# EAGLE design 240VAC_dimmer (EAGLE 6.3)
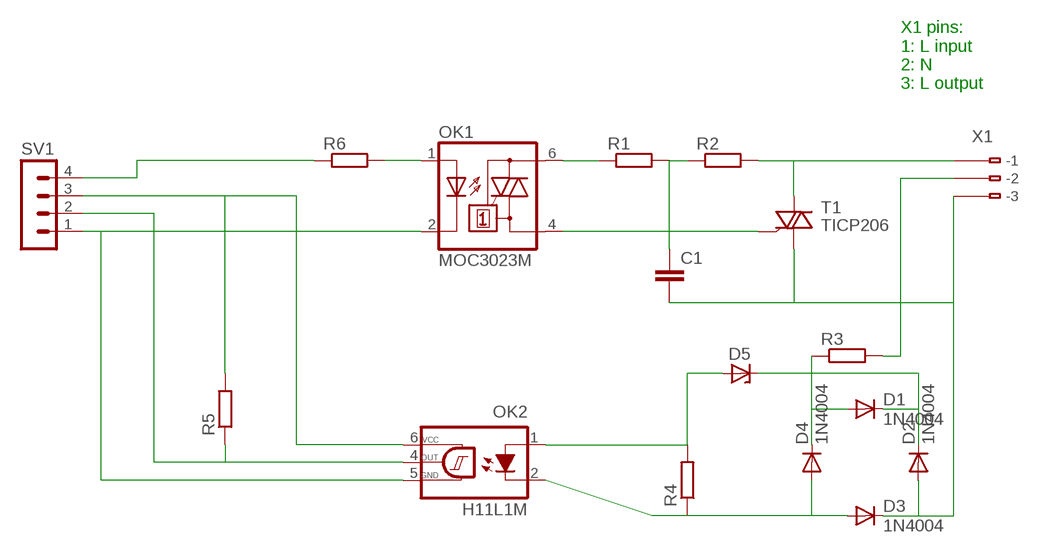
[diagram p0: schematic, sheet 1]

## Parts
C1  C-EU050-030X075  [C050-030X075]
D1  1N4004  [DO41-10]
D2  1N4004  [DO41-10]
D3  1N4004  [DO41-10]
D4  1N4004  [DO41-10]
D5  ZENER-DIODEDO41Z10  [DO41Z10]
OK1  MOC3023M  [DIL06]
OK2  H11L1M  [DIL06]
R1  R-EU_0411/12  [0411/12]
R2  R-EU_0411/12  [0411/12]
R3  R-EU_0207/10  [0207/10]
R4  R-EU_0204/7  [0204/7]
R5  R-EU_0204/7  [0204/7]
R6  R-EU_0204/7  [0204/7]
SV1  MA04-1  [MA04-1]
T1  TICP206  [TO92-6]
X1  233-103  [233-103]

## Nets
N$1: OK1.6(A2) R1.1
N$2: C1.1 R1.2 R2.1
N$3: R2.2 T1.A2 X1.B1(B-1)
N$4: OK1.4(A1) T1.G
N$5: C1.2 D2.A D3.C T1.A1 X1.B3(B-3)
N$6: D1.A D4.C R3.1
N$7: D3.A D4.A OK2.2(C) R4.1
N$8: D5.A OK2.1(A) R4.2
N$9: D1.C D2.C D5.C
N$10: OK1.2(C) OK2.5(GND) SV1.1
N$11: OK2.4(OUT) R5.1 SV1.2
N$12: OK2.6(VCC) R5.2 SV1.3
N$13: OK1.1(A) R6.2
N$14: R6.1 SV1.4
N$15: R3.2 X1.B2(B-2)
Unconnected: X1.A1(-1) X1.A2(-2) X1.A3(-3)

## Notes on the sheet
- X1 pins:
  1: L input
  2: N
  3: L output

## Library data of the parts
C1 = resistor:C-EU: CAPACITOR, European symbol
D1-D4 = diode:1N4004: DIODE general purpose rectifier, 1 A
D5 = diode:ZENER-DIODE: Z-Diode
OK1 = optocoupler:MOC30*M: RANDOM-PHASE OPTOISOLATORS TRIAC DRIVER OUTPUT Source: http://www.fairchildsemi.com MOC3020-M.pdf; MF: FAIRCHILD SEMICONDUCTOR; MPN: MOC3023-M; OC_FARNELL: 1021367; OC_NEWARK: 72K8896
OK2 = optocoupler:H11L*M: 6-Pin DIP Optocoupler Source: http://www.fairchildsemi.com/ds/H1/H11L2-M.pdf; MF: FAIRCHILD SEMICONDUCTOR; MPN: H11L1-M; OC_FARNELL: 1021127; OC_NEWARK: 72K8643
R1-R6 = resistor:R-EU_: RESISTOR, European symbol
SV1 = con-lstb:MA04-1: PIN HEADER; OC_FARNELL: unknown; OC_NEWARK: unknown
T1 = triac:TICP206: TRIAC
X1 = con-wago:233-103: WAGO Cage Clamp; MPN: 233-103; OC_FARNELL: unknown; OC_NEWARK: 28K9045

## Board
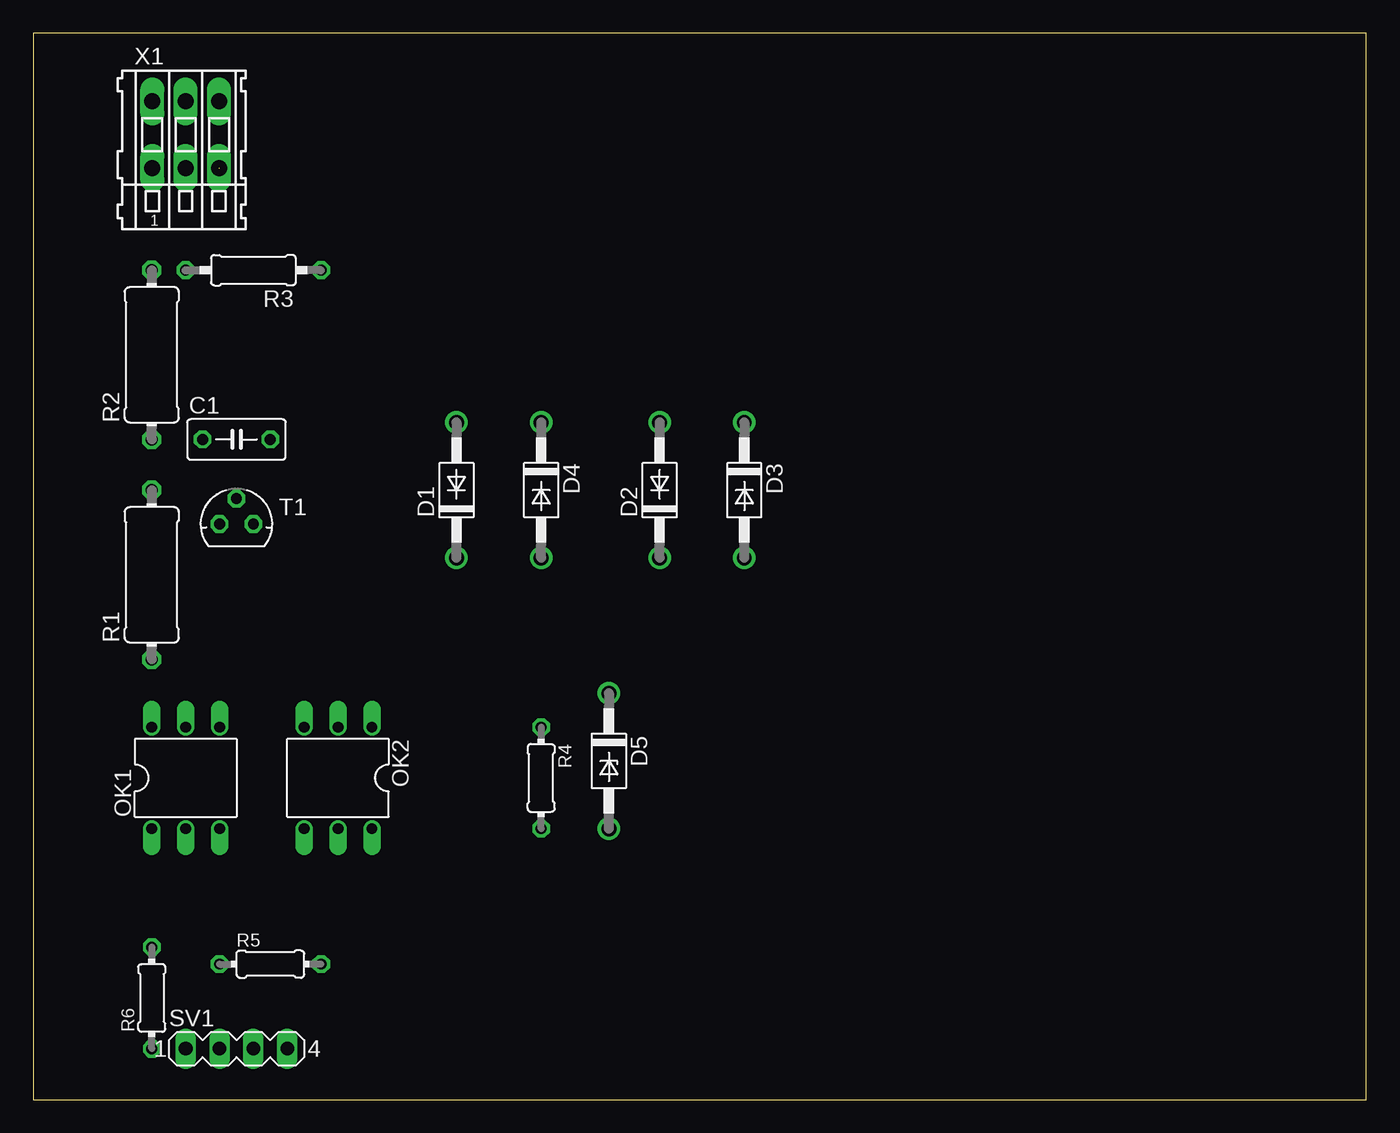
[diagram p1: board, top side]
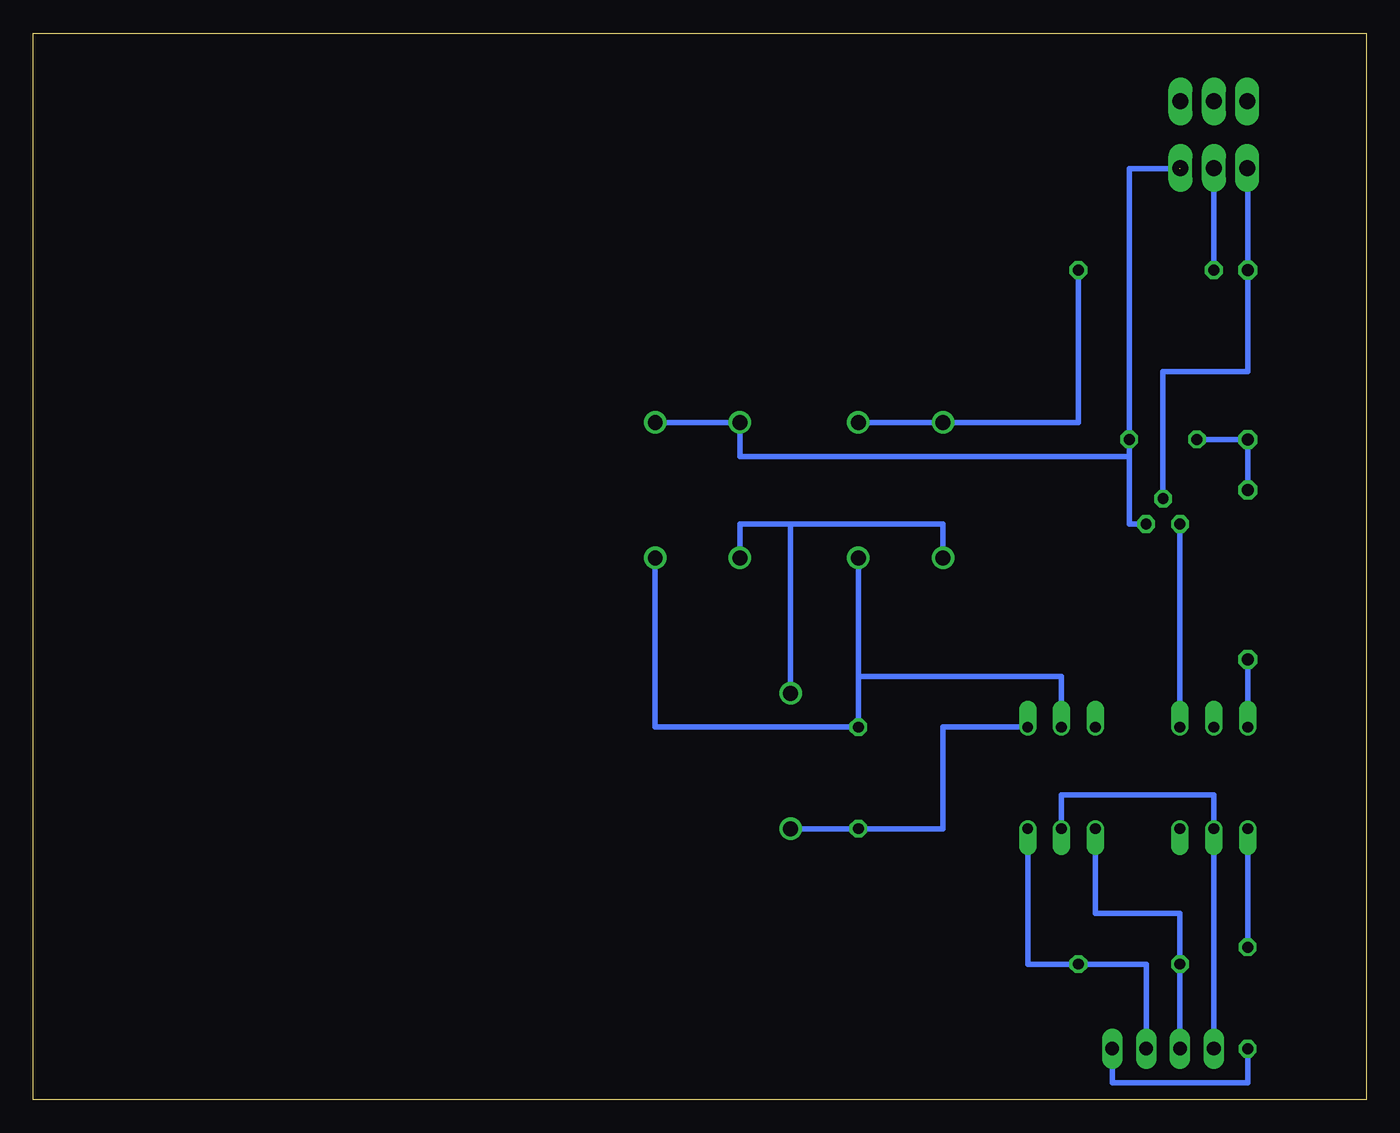
[diagram p2: board, bottom side, seen from below]

Size 100 x 80 mm. Coordinates in mm from the lower left corner, seen from the top.
Outline: 0,0 100,0 100,80 0,80 0,0
Copper layers (1*16): Top 0.035mm / dielectric 1.5mm / Bottom 0.035mm
Design rules "default": minimum track width 10mil, minimum drill 24mil, track to track 8mil, track to pad 8mil, pad to pad 8mil, via to via 8mil, smd to smd 8mil, copper to edge 40mil, drill to drill 8mil, minimum pad ring 10mil, minimum via ring 8mil, stop-mask expansion 4mil, vias tented up to drill 0mil, thermal gap 10mil

### Footprints (pad centres in the part's own frame; a part is rotated, then mirrored left to right if it is on the bottom)
C050-030X075 = drill 0.813 octagon: 1 -2.54,0; 2 2.54,0
DO41-10 = drill 1.118: A 5.08,0; C -5.08,0
DO41Z10 = drill 1.118: A 5.08,0; C -5.08,0
DIL06 = drill 0.813 offset: 1 -2.54,-3.81; 2 0,-3.81; 3 2.54,-3.81; 4 2.54,3.81; 5 0,3.81; 6 -2.54,3.81
0411/12 = drill 0.914 octagon: 1 -6.35,0; 2 6.35,0
0207/10 = drill 0.813 octagon: 1 -5.08,0; 2 5.08,0
0204/7 = drill 0.813 octagon: 1 -3.81,0; 2 3.81,0
MA04-1 = drill 1.016 long: 1 -3.81,0; 2 -1.27,0; 3 1.27,0; 4 3.81,0
TO92-6 = drill 0.813 octagon: A1 1.27,0; A2 0,1.905; G -1.27,0
233-103 = drill 1.2 long: A1 -2.5,2.5; A2 0,2.5; A3 2.5,2.5; B1 -2.5,-2.5; B2 0,-2.5; B3 2.5,-2.5

### Placement (x,y rotation side)
C1  15.24,49.53 0 top
D1  31.75,45.72 90 top
D2  46.99,45.72 90 top
D3  53.34,45.72 270 top
D4  38.1,45.72 270 top
D5  43.18,25.4 270 top
OK1  11.43,24.13 0 top
OK2  22.86,24.13 180 top
R1  8.89,39.37 90 top
R2  8.89,55.88 90 top
R3  16.51,62.23 180 top
R4  38.1,24.13 270 top
R5  17.78,10.16 0 top
R6  8.89,7.62 90 top
SV1  15.24,3.81 0 top
T1  15.24,43.18 0 top
X1  11.43,72.39 0 top

### Tracks (layer width: path | path; a pad name or v marks a point on that pad's centre or on a via)
N$1
  Bottom 0.406: OK1.6 R1.1
N$2
  Bottom 0.406: R1.2 R2.1 C1.1
N$3
  Bottom 0.406: X1.B1 8.89,69.89 R2.2 8.89,54.61 15.24,54.61 T1.A2
N$4
  Bottom 0.406: OK1.4 T1.G
N$5  (1 unrouted)
  Bottom 0.406: D3.C D2.A 46.99,48.26 17.78,48.26 C1.2 | C1.2 17.78,43.18 T1.A1 | C1.2 17.78,69.85 13.97,69.85
N$6
  Bottom 0.406: R3.1 21.59,50.8 D1.A D4.C
N$7
  Bottom 0.406: D4.A 38.1,31.75 | D3.A 53.34,27.94 R4.1 38.1,31.75 | 38.1,31.75 22.86,31.75 OK2.2
N$8
  Bottom 0.406: OK2.1 31.75,27.94 31.75,20.32 R4.2 D5.A
N$9
  Bottom 0.406: D5.C 43.18,43.18 | 43.18,43.18 46.99,43.18 D2.C | 43.18,43.18 31.75,43.18 D1.C
N$10
  Bottom 0.406: SV1.1 OK1.2 11.43,22.86 22.86,22.86 OK2.5
N$11
  Bottom 0.406: R5.1 SV1.2 13.97,13.97 20.32,13.97 OK2.4
N$12
  Bottom 0.406: SV1.3 16.51,10.16 R5.2 25.4,10.16 OK2.6
N$13
  Bottom 0.406: R6.2 OK1.1
N$14
  Bottom 0.406: R6.1 8.89,1.27 19.05,1.27 SV1.4
N$15
  Bottom 0.406: X1.B2 R3.2